# EAGLE design leaf_xcvr_rs485_bro (EAGLE 7.6.0)
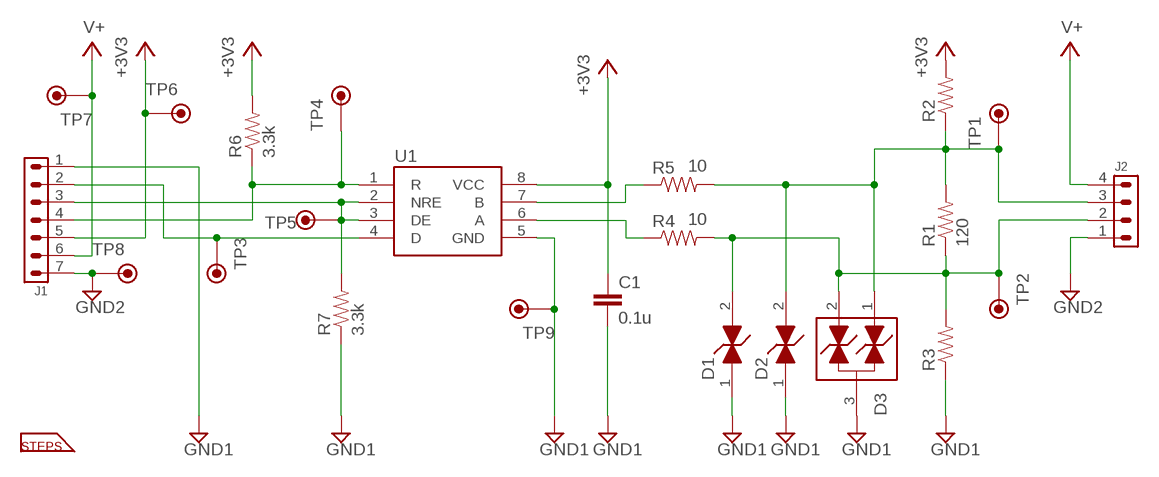
[diagram p0: schematic, sheet 1]

## Parts
C1  0.1u  0603_CAP  [0603]
D1  TVS_DO-214AA  [DO-214AA_LITTELFUSE]
D2  TVS_DO-214AA  [DO-214AA_LITTELFUSE]
D3  TVS_SOT-23  [SOT-23_ONSEMI]
J1  CONN_7X1_JST_PA  [CONN_7X1_JST_PA]
J2  CONN_4X1_JST_PA  [CONN_4X1_JST_PA]
R1  120  0603_RES  [0603]
R2  0603_RES  [0603]
R3  0603_RES  [0603]
R4  10  0603_RES  [0603]
R5  10  0603_RES  [0603]
R6  3.3k  0603_RES  [0603]
R7  3.3k  0603_RES  [0603]
TP1  TP1  [TP1]
TP2  TP1  [TP1]
TP3  TP1  [TP1]
TP4  TP1  [TP1]
TP5  TP1  [TP1]
TP6  TP1  [TP1]
TP7  TP1  [TP1]
TP8  TP1  [TP1]
TP9  TP1  [TP1]
U1  RS485_XCVR_SN65HVD178X  [SOIC_08_TI]
U$1  STEPS_LOGO  [STEPS_LOGO]

## Nets
+3V3: C1.P$1 J1.5 R2.P$2 R6.P$2 TP6.P$1 U1.8(VCC)
GND1: C1.P$2 D1.1 D2.1 D3.3 J1.1 R3.P$1 R7.P$1 TP9.P$1 U1.5(GND)
GND2: J1.7 J2.1 TP8.P$1
N$1: R4.P$1 U1.6(A)
N$2: R5.P$1 U1.7(B)
N$6: D1.2 D3.2 J2.2 R1.P$1 R3.P$2 R4.P$2 TP2.P$1
N$7: D2.2 D3.1 J2.3 R1.P$2 R2.P$1 R5.P$2 TP1.P$1
N$8: J1.3 R7.P$2 TP5.P$1 U1.2(NRE) U1.3(DE)
N$9: J1.4 R6.P$1 TP4.P$1 U1.1(R)
N$10: J1.2 TP3.P$1 U1.4(D)
V+: J1.6 J2.4 TP7.P$1

## Library data of the parts
C1 = stepOSP:0603_CAP
D1 D2 = leaf:TVS_DO-214AA
D3 = leaf:TVS_SOT-23
J1 = leaf:CONN_7X1_JST_PA
J2 = leaf:CONN_4X1_JST_PA
R1-R7 = stepOSP:0603_RES
TP1-TP9 = leaf:TP1
U1 = leaf:RS485_XCVR_SN65HVD178X
U$1 = stepOSP:STEPS_LOGO

## Board
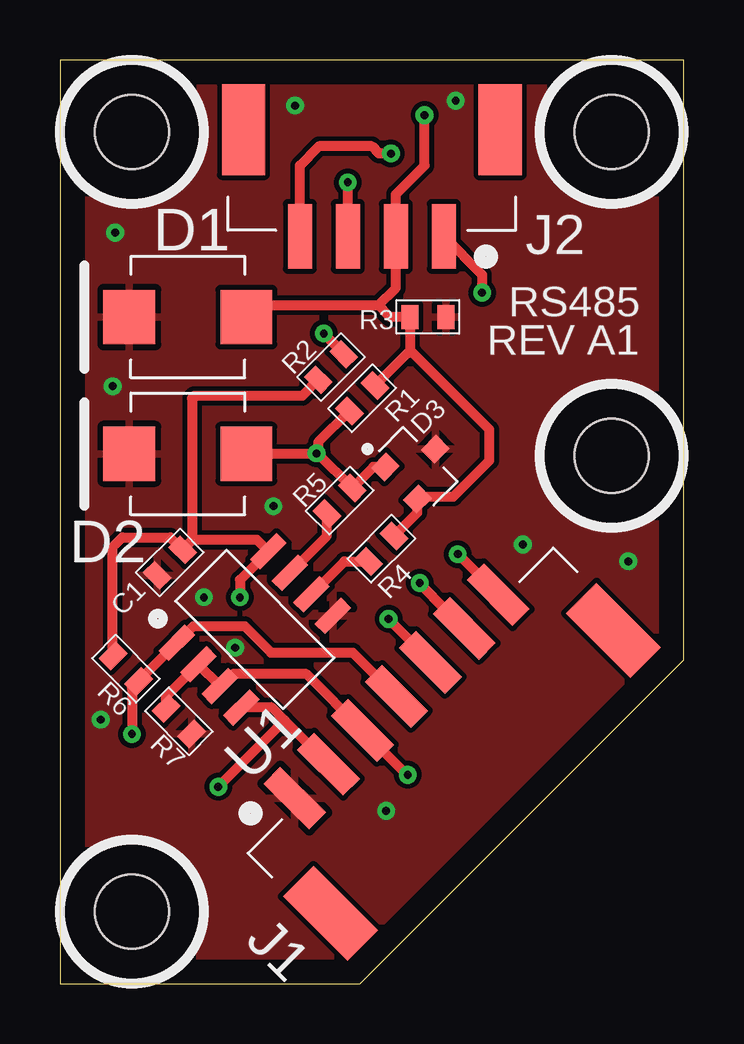
[diagram p1: board, top side]
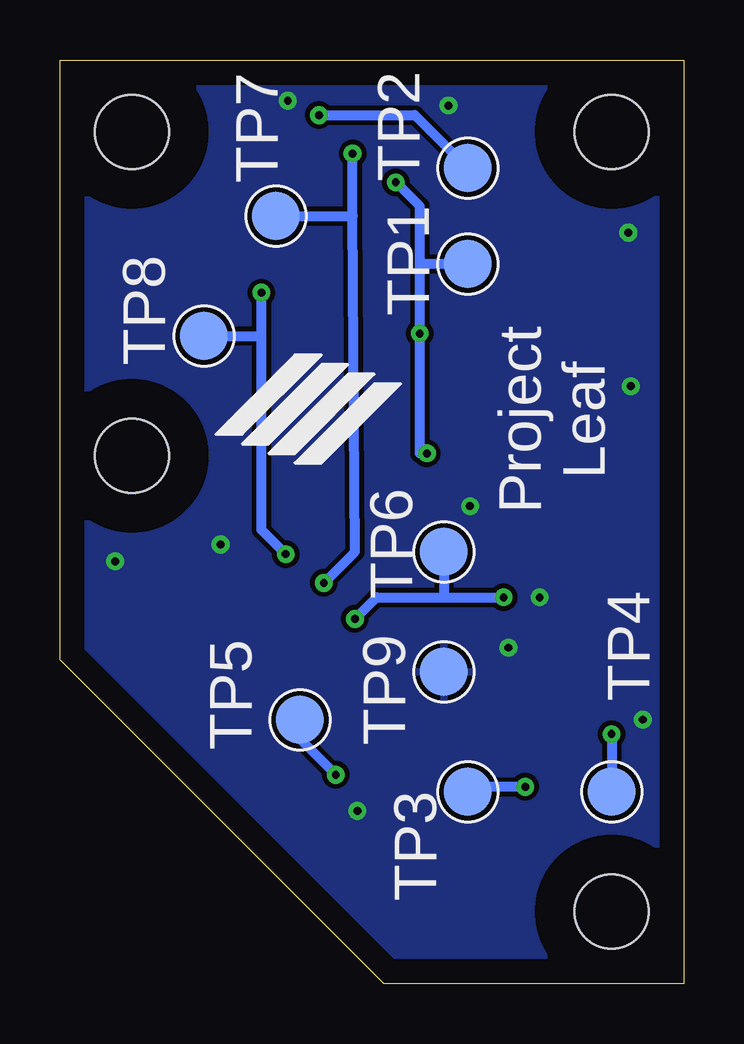
[diagram p2: board, bottom side, seen from below]

Size 26 x 38.5 mm. Coordinates in mm from the lower left corner, seen from the top.
Outline: 26,13.5 26,38.5 0,38.5 0,0 12.5,0 26,13.5
Copper layers (1*16): Top 0.035mm / dielectric 1.5mm / Bottom 0.035mm
Design rules "default *": minimum track width 10mil, minimum drill 13mil, track to track 8mil, track to pad 8mil, pad to pad 8mil, via to via 8mil, smd to smd 8mil, copper to edge 40mil, drill to drill 8mil, minimum pad ring 10mil, minimum via ring 8mil, stop-mask expansion 4mil, vias tented up to drill 15mil, thermal gap 10mil
Holes 3.1 mm at 3,3 23,22 3,35.5 23,35.5
tRestrict: area 20,19 to 26,25; area 20,32.5 to 26,38.5; area 0,32.5 to 6,38.5; area 0,0 to 6,6
bRestrict: area 0,0 to 6,6; area 20,19 to 26,25; area 0,32.5 to 6,38.5; area 20,32.5 to 26,38.5

### Footprints (pad centres in the part's own frame; a part is rotated, then mirrored left to right if it is on the bottom)
0603 = smd 0.7 x 1: P$1 -0.75,0; P$2 0.75,0
DO-214AA_LITTELFUSE = smd 2.159 x 2.261: 1 -2.438,0; 2 2.438,0
SOT-23_ONSEMI = smd 0.8 x 0.9: 1 -0.95,-1; 2 0.95,-1; 3 0,1
CONN_7X1_JST_PA = smd 1 x 2.7: 1 6,-9.15; 2 4,-9.15; 3 2,-9.15; 4 0,-9.15; 5 -2,-9.15; 6 -4,-9.15; 7 -6,-9.15 | smd 1.8 x 3.8: P$1 8.35,-4.7; P$2 -8.35,-4.7
CONN_4X1_JST_PA = smd 1 x 2.7: 1 3,-9.15; 2 1,-9.15; 3 -1,-9.15; 4 -3,-9.15 | smd 1.8 x 3.8: P$1 5.35,-4.7; P$2 -5.35,-4.7
TP1 = smd 2 x 2: P$1 0,0
SOIC_08_TI = smd 0.6 x 1.55: 1 0,-2.7; 2 1.27,-2.7; 3 2.54,-2.7; 4 3.81,-2.7; 5 3.81,2.7; 6 2.54,2.7; 7 1.27,2.7; 8 0,2.7

### Placement (x,y rotation side)
C1  4.58,17.55 225 top
D1  5.33,27.78 0 top
D2  5.33,22.08 0 top
D3  14.94,21.57 315 top
J1  20.5,5.5 225 top
J2  13,40.3 0 top
R1  12.6,24.4 225 top
R2  11.3,25.7 225 top
R3  15.34,27.79 180 top
R4  13.4,18.13 45 top
R5  11.66,20.13 45 top
R6  2.75,13.13 135 top
R7  4.96,10.93 135 top
TP1  9,30 0 bottom
TP2  9,34 0 bottom
TP3  9,8 0 bottom
TP4  3,8 0 bottom
TP5  16,11 0 bottom
TP6  10,18 0 bottom
TP7  17,32 0 bottom
TP8  20,27 0 bottom
TP9  10,13 0 bottom
U1  6.78,16.11 315 top
U$1  19.5,22.9 0 bottom

### Tracks (layer width: path | path; a pad name or v marks a point on that pad's centre or on a via)
+3V3  (via drill 0.33)
  Top 0.406: 5.5,18.5 8.21,18.5 U1.8 7.5,16.83 v7.5,16.1 | 5.5,18.5 5.11,18.11 C1.P$1 4.6,18.6 2.6,18.6 2.2,18.2 2.2,13.64 R6.P$2 | R2.P$2 10.1,24.5 5.6,24.5 5.5,24.4 5.5,18.5 | v13.7,15.2 15.52,13.38 J1.5
  Bottom 0.406: v13.7,15.2 12.8,16.1 10,16.1 | 10,16.1 v7.5,16.1 | TP6.P$1 10,16.1
GND1  (via drill 0.33)
  other vias: 6,16.1 2.2,24.9 2.3,31.3 9.8,36.6 16.5,36.8 8.9,19.9 1.7,11 7.3,14 13.6,7.2 19.3,18.3 23.7,17.6
  pour Top: 0,-0.1 12.4,-0.1 26,13.5 26,38.4 26.1,38.5 0,38.5
  pour Bottom: 0,0 12.5,0 26,13.5 26,38.4 0,38.4
GND2  (via drill 0.33)
  Top 0.406: J1.7 v16.59,17.9 | J2.1 17.6,29.55 v17.6,28.8
  Bottom 0.406: v16.59,17.9 17.6,18.91 17.6,27 | 17.6,27 v17.6,28.8 | TP8.P$1 17.6,27
N$1
  Top 0.406: U1.6 11.86,17.6 R4.P$1
N$2
  Top 0.406: U1.7 11.13,18.66 R5.P$1
N$6  (via drill 0.33)
  Top 0.406: 13.28,28.28 14,29 J2.2 14,32.9 15.2,34.1 v15.2,36.2 | 13.28,28.28 13.77,27.79 R3.P$2 14.6,26.29 | D1.2 7.27,28.28 13.28,28.28 | R4.P$2 14.9,19.64 D3.2 15.01,20.3 16.4,20.3 17.9,21.8 17.9,23.1 14.71,26.29 14.6,26.29 | R1.P$1 14.49,26.29 14.6,26.29
  Bottom 0.406: v15.2,36.2 11.2,36.2 TP2.P$1
N$7  (via drill 0.33)
  Top 0.406: D3.1 13.06,21.54 R5.P$2 10.77,22.08 | 10.77,22.08 10.7,22.08 | 10.7,22.08 D2.2 | R1.P$2 10.77,22.57 10.77,22.08 | J2.3 v12,33.4 | R2.P$1 v11,27.1 | v10.7,22.1 10.7,22.08
  Bottom 0.406: v10.7,22.1 11,22.1 v11,27.1 11,30 | 11,30 11,32.4 v12,33.4 | TP1.P$1 11,30
N$8  (via drill 0.33)
  Top 0.406: R7.P$2 4.43,11.96 U1.2 U1.3 6.71,12.4 7.2,12.9 10.27,12.9 J1.3 14.47,8.7 v14.5,8.7
  Bottom 0.406: v14.5,8.7 16,10.2 TP5.P$1
N$9  (via drill 0.33)
  Top 0.406: J1.4 12.2,13.8 8.8,13.8 7.7,14.9 5.57,14.9 U1.1 3.57,12.9 R6.P$1 3,12.32 v3,10.4 | J1.4
  Bottom 0.406: v3,10.4 TP4.P$1
N$10  (via drill 0.33)
  Top 0.406: J1.2 9.37,10.97 | 9.37,10.97 8.84,11.51 U1.4 | v6.6,8.2 9.37,10.97
  Bottom 0.406: v6.6,8.2 8.8,8.2 TP3.P$1
V+  (via drill 0.33)
  Top 0.406: J2.4 10,34.1 10.8,34.9 13,34.9 13.3,34.6 v13.8,34.6 | v15,16.7 16.8,14.8 J1.6
  Bottom 0.406: v15,16.7 13.7,18 13.8,32 | 13.8,32 v13.8,34.6 | TP7.P$1 13.8,32

### Text on the board
tPlace: RS485 | REV A1
bPlace: Project / Leaf